# Altium schematic sheet PCB_BLU2.SchDoc
size A4
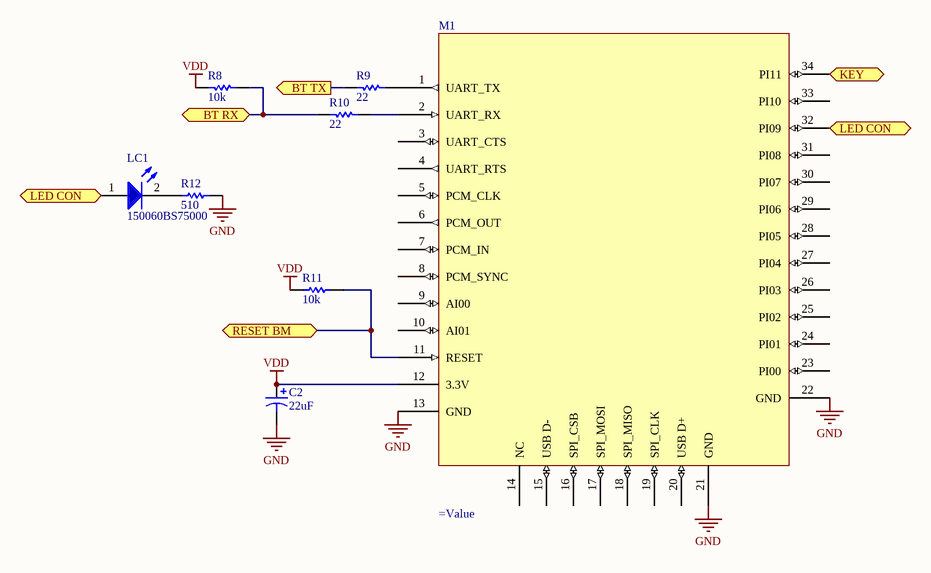
[diagram p0: PCB_BLU2.SchDoc]

## Parts
C2  22uF  [6032]
LC1  150060BS75000  [LED_0603_Blue]
M1  (no value)  [HC-05-LAND]
R8  10k  [RES0201R]
R9  22  [RES0201R]
R10  22  [RES0201R]
R11  10k  [RES0402R]
R12  510  [RES0402R]

## Ports
BT RX (bidir), BT TX (out), KEY (bidir), LED CON (bidir), RESET BM (bidir)

## Nets
GND: C2.2 M1.13(GND) M1.21(GND) M1.22(GND) R12.2
VDD: C2.1 M1.12(3.3V) R8.1 R11.1
BT RX: R8.2 R10.1 ; port BT RX
BT TX: R9.1 ; port BT TX
KEY: M1.34(PI11) ; port KEY
LED CON: LC1.1(A) M1.32(PI09) ; port LED CON
RESET BM: M1.11(RESET) R11.2 ; port RESET BM
NetLC1_2: LC1.2(C) R12.1
NetM1_1: M1.1(UART_TX) R9.2
NetM1_2: M1.2(UART_RX) R10.2

Not connected (* = marked no-connect by the designer): M1 3(UART_CTS) 4(UART_RTS) 5(PCM_CLK) 6(PCM_OUT) 7(PCM_IN) 8(PCM_SYNC) 9(AI00) 10(AI01) 14(NC) 15(USB_D-) 16(SPI_CSB) 17(SPI_MOSI) 18(SPI_MISO) 19(SPI_CLK) 20(USB_D+) 23(PI00) 24(PI01) 25(PI02) 26(PI03) 27(PI04) 28(PI05) 29(PI06) 30(PI07) 31(PI08) 33(PI10)

## Library data of the parts
C2 = CWR11DH226M: Tantamount Military, Surface Mount MIL-PRF-55365/8 Qualified Solid Tantalum Chip Capacitor: 22uF, 20% Tolerance, 6 WVDC @ +85°C, Surge = 8V; Note: See Data Sheet for full range of components; Published: 19-Mar-2004; DatasheetDocument: 20-Mar-2003; PackageReference: 6032; Publisher: Altium Limited; Code_JEITA: 6032; ComponentLink1Description: Manufacturer Link; ComponentLink1URL: http://www.vishay.com/; ComponentLink2Description: Datasheet; ComponentLink2URL: http://www.vishay.com/docs/40011/cwr11.pdf; Value: 22uF
LC1 = WL-SMCW 0603  150060BS75000: SMD mono-color Chip LED, WL-SMCW, Blue; Manufacturer: W黵th Elektronik eiSos GmbH; PartNo: 150060BS75000; ComponentLink1Description: Manufacturer; ComponentLink1URL: http://www.we-online.de; Created by: Christin Otto; Created Date: June 2013; ComponentLink2Description: Datasheet; ComponentLink2URL: http://katalog.we-online.com/led/datasheet/150060BS75000.pdf; Color: Blue
M1 = HC-05MOD: HC-05 Module; Value: =Value; Type: HC-05 Bluetooth module
R8-R12 = Resistor1: Resistor; Value: =Value